# EAGLE design TTL (EAGLE 6.2)
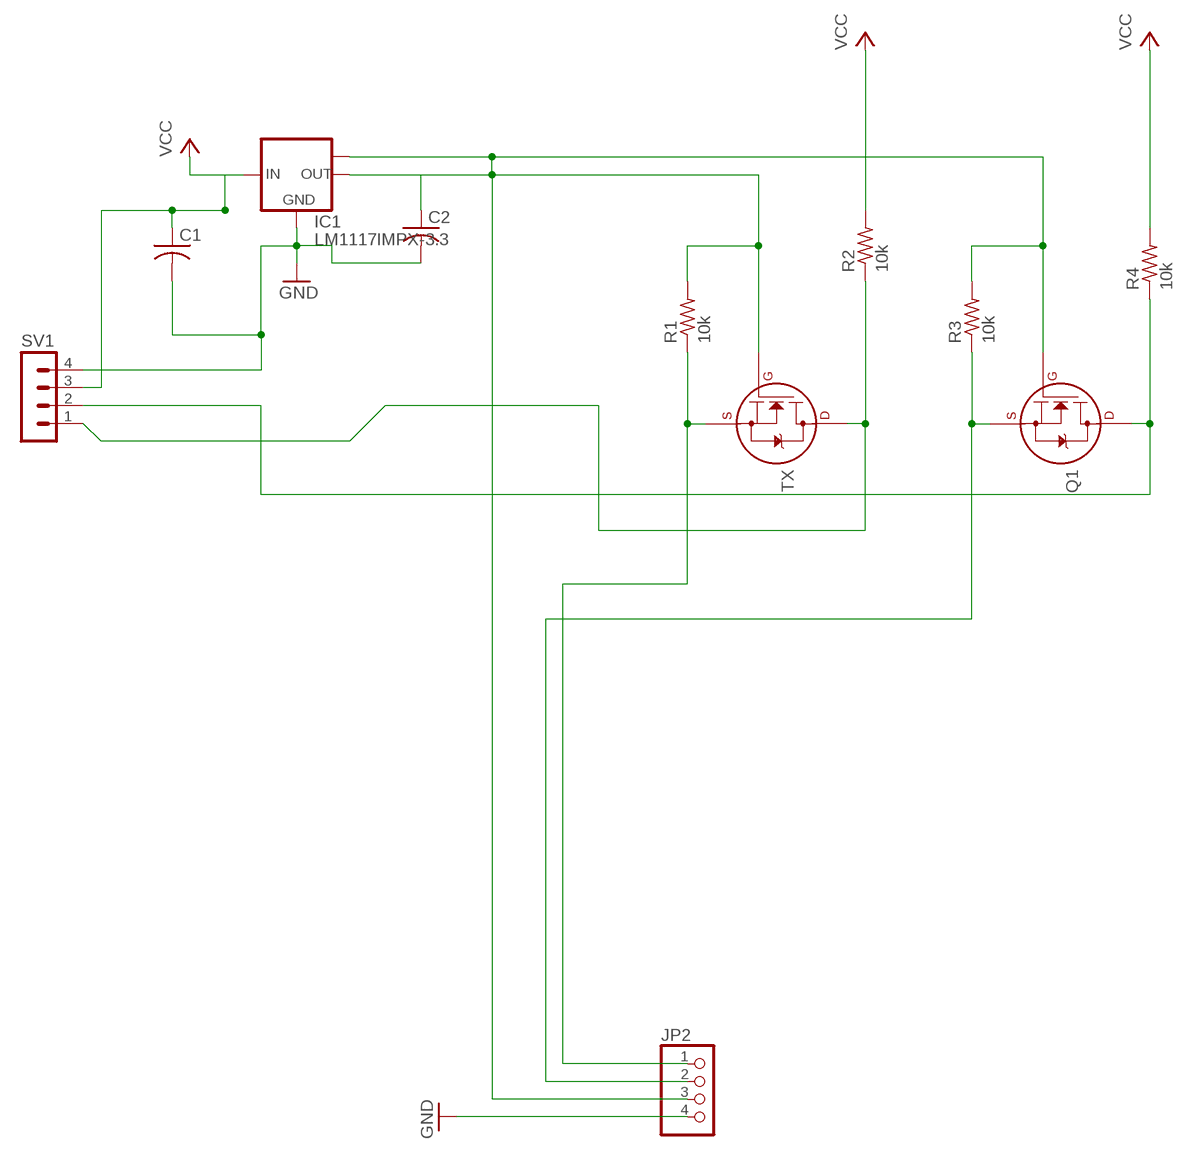
[diagram p0: schematic, sheet 1]

## Parts
C1  C-USC0805  [C0805]
C2  C-USC0805  [C0805]
IC1  LM1117IMPX-3.3  [SOT223]
JP2  PINHD-1X4  [1X04]
Q1  2N7002_SOT23  [SOT-23]
R1  10k  R-US_M0805  [M0805]
R2  10k  R-US_M0805  [M0805]
R3  10k  R-US_M0805  [M0805]
R4  10k  R-US_M0805  [M0805]
SV1  MA04-1  [MA04-1]
TX  2N7002_SOT23  [SOT-23]

## Nets
GND: C1.2 C2.2 IC1.1(GND) JP2.4 SV1.4
N$1: JP2.1 R1.1 TX.2(S)
N$2: R2.1 SV1.1 TX.3(D)
N$3: JP2.2 Q1.2(S) R3.1
N$4: Q1.3(D) R4.1 SV1.2
N$5: C2.1 IC1.2(OUT) IC1.TAB(OUT1) JP2.3 Q1.1(G) R1.2 R3.2 TX.1(G)
VCC: C1.1 IC1.3(IN) R2.2 R4.2 SV1.3

## Library data of the parts
C1 C2 = rcl:C-US: CAPACITOR, American symbol
IC1 = lm1117 (1):LM1117IMPX-*
JP2 = pinhead:PINHD-1X4: PIN HEADER
Q1 TX = transistors:2N700*: 2N7000, 2N7002, NDS7002A N-channel enhancement mode MOSFET
R1-R4 = rcl:R-US_: RESISTOR, American symbol
SV1 = con-lstb:MA04-1: PIN HEADER; OC_FARNELL: unknown; OC_NEWARK: unknown

## Board
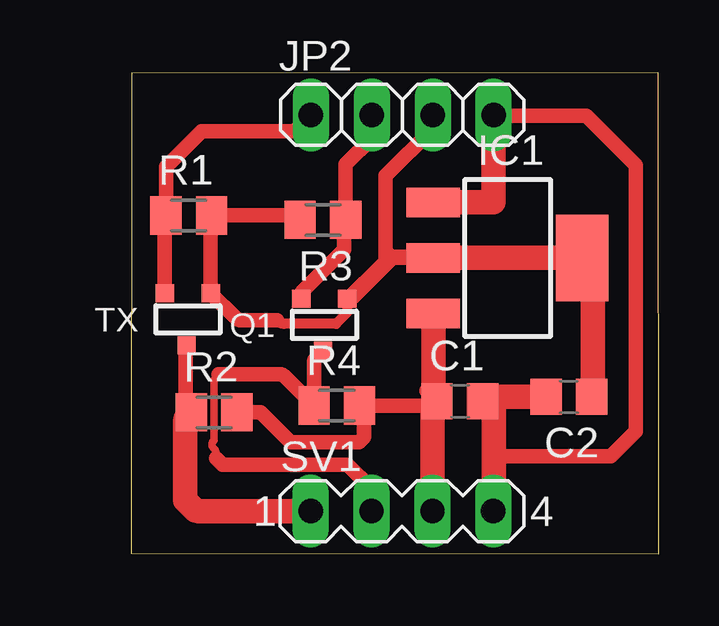
[diagram p1: board, top side]
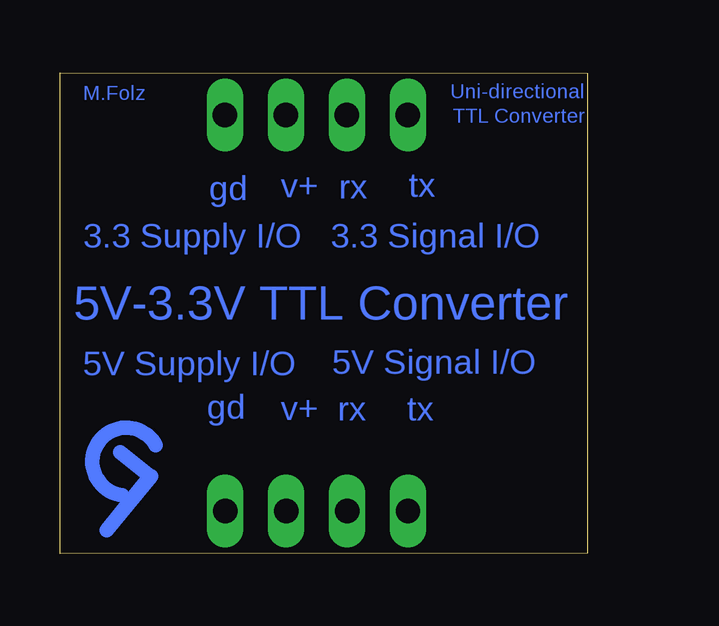
[diagram p2: board, bottom side, seen from below]

Size 21.98 x 20.04 mm. Coordinates in mm from the lower left corner, seen from the top.
Outline: 0,0.02 21.98,0 21.98,20.04 0,20.01 0,0.02
Copper layers (1*16): Top 0.035mm / dielectric 1.5mm / Bottom 0.035mm
Design rules: minimum track width 10mil, minimum drill 24mil, track to track 8mil, track to pad 8mil, pad to pad 8mil, via to via 8mil, smd to smd 8mil, copper to edge 40mil, drill to drill 8mil, minimum pad ring 10mil, minimum via ring 8mil, stop-mask expansion 4mil, vias tented up to drill 0mil, thermal gap 10mil

### Footprints (pad centres in the part's own frame; a part is rotated, then mirrored left to right if it is on the bottom)
C0805 = smd 1.3 x 1.5: 1 -0.95,0; 2 0.95,0
SOT223 = smd 1.219 x 2.235: 1 -2.311,-3.099; 2 0,-3.099; 3 2.311,-3.099 | smd 3.6 x 2.2: TAB 0,3.099
1X04 = drill 1.016 long: 1 -3.81,0; 2 -1.27,0; 3 1.27,0; 4 3.81,0
SOT-23 = smd 0.762 x 0.762: 1 -0.979,-1.101; 2 0.94,-1.101; 3 0.025,1.067
M0805 = smd 1.3 x 1.6: 1 -0.95,0; 2 0.95,0
MA04-1 = drill 1.016 long: 1 -3.81,0; 2 -1.27,0; 3 1.27,0; 4 3.81,0

### Placement (x,y rotation side)
C1  13.7,6.35 0 top
C2  18.24,6.54 180 top
IC1  15.69,12.32 270 top
JP2  11.29,18.29 0 top
Q1  8.02,9.52 180 top
R1  2.39,14.09 0 top
R2  3.45,5.89 0 top
R3  7.99,13.91 180 top
R4  8.56,6.17 0 top
SV1  11.28,1.78 0 top
TX  2.33,9.75 180 top

### Tracks (layer width: path | path; a pad name or v marks a point on that pad's centre or on a via)
GND
  Top 0.61: 15.1,14.63 14.93,14.63 14.93,16.6 | C1.2 17.16,6.35 17.19,6.38 15.03,6.38 15.03,4.18 15.16,4.05 19.98,4.05 21.03,5.1 21.03,16.18 18.97,18.24 15.15,18.24 JP2.4
  Top 1.016: C2.2 14.83,6.54 C1.2 14.99,6.35 15.11,6.47 15.11,1.8 SV1.4 | IC1.1 15.1,14.63 JP2.4
N$1
  Top 0.61: TX.2 1.39,14.04 R1.1 1.44,16.12 2.93,17.61 6.81,17.61 JP2.1
N$2
  Top 0.61: R2.1 arc45 2.41,6.11 2.16,6.36 arc45 2.18,6.31 2.27,6.22 2.27,8.6 arc-45 TX.3
  Top 1.016: SV1.1 2.83,1.78 arc-45 2.6,1.87 2.25,2.22 2.25,5.51 arc-45 2.34,5.74 R2.1
N$3
  Top 0.61: JP2.2 10.04,18.27 10.04,17.32 8.94,16.22 R3.1 arc45 8.86,13.73 8.86,12.67 7.17,10.98 arc45 7.08,10.76 Q1.2
N$4
  Top 0.305: 3.53,3.98 3.53,4.17 arc45 3.44,4.4 3.36,4.47 3.36,4.53 arc-45 3.44,4.72 3.44,7.16 arc-45 3.53,7.39 3.63,7.48
  Top 0.61: SV1.2 10.01,2.72 9.02,3.71 3.8,3.71 3.53,3.98 | 3.63,7.48 6.17,7.48 arc-45 6.39,7.39 R4.1 7.61,7.94 arc-45 7.71,8.17 Q1.3
N$5
  Top 0.406: 9,10.58 9,10.17 arc-45 8.91,9.95 8.54,9.58 6.36,9.58 arc-45 6.14,9.68 6.08,9.73
  Top 0.61: R3.2 6.86,14.09 R1.2 3.31,14.06 TX.1 4.34,9.83 arc45 4.57,9.73 6.08,9.73 | JP2.3 12.56,17.72 10.6,15.75 10.6,12.6 | 10.6,12.6 10.6,12.57 | 10.6,12.57 10.8,12.37 12.54,12.37 IC1.2 10.88,12.32 | 10.88,12.32 10.6,12.6 | Q1.1 9.05,10.62 arc45 9.27,10.72 10.88,12.32 | 10.6,12.57 10.6,12.31 arc-45 10.51,12.09 9,10.58
  Top 0.813: IC1.TAB 18.94,12.32 19.42,11.84 19.42,11.3 19.23,11.11
  Top 1.016: 19.23,11.11 19.23,6.57 C2.1 | IC1.TAB IC1.2
N$6
  Bottom 0.61: 17.99,4.52 arc-235 19.38,2.44
N$7
  Bottom 0.61: 18.19,3.23 20.03,0.97 18.22,3.23 19.47,4.22
VCC
  Top 0.61: 12.31,6.79 C1.1 12.56,6.17 R4.2 9.7,5.98 9.7,4.85 9.49,4.64 6.64,4.64 5.39,5.89 R2.2
  Top 1.016: SV1.3 12.55,5.88 | 12.55,5.88 12.55,6.16 C1.1 | IC1.3 12.59,5.92 12.55,5.88

### Text on the board
Bottom: Uni-directional | M.Folz | TTL Converter | tx | rx | v+ | gd | 3.3 Signal I/O | 3.3 Supply I/O | 5V-3.3V TTL Converter | 5V Signal I/O | 5V Supply I/O | tx | rx | v+ | gd
tNames: fsdf | TX